# Altium schematic sheet Microcontroller.SchDoc
size A
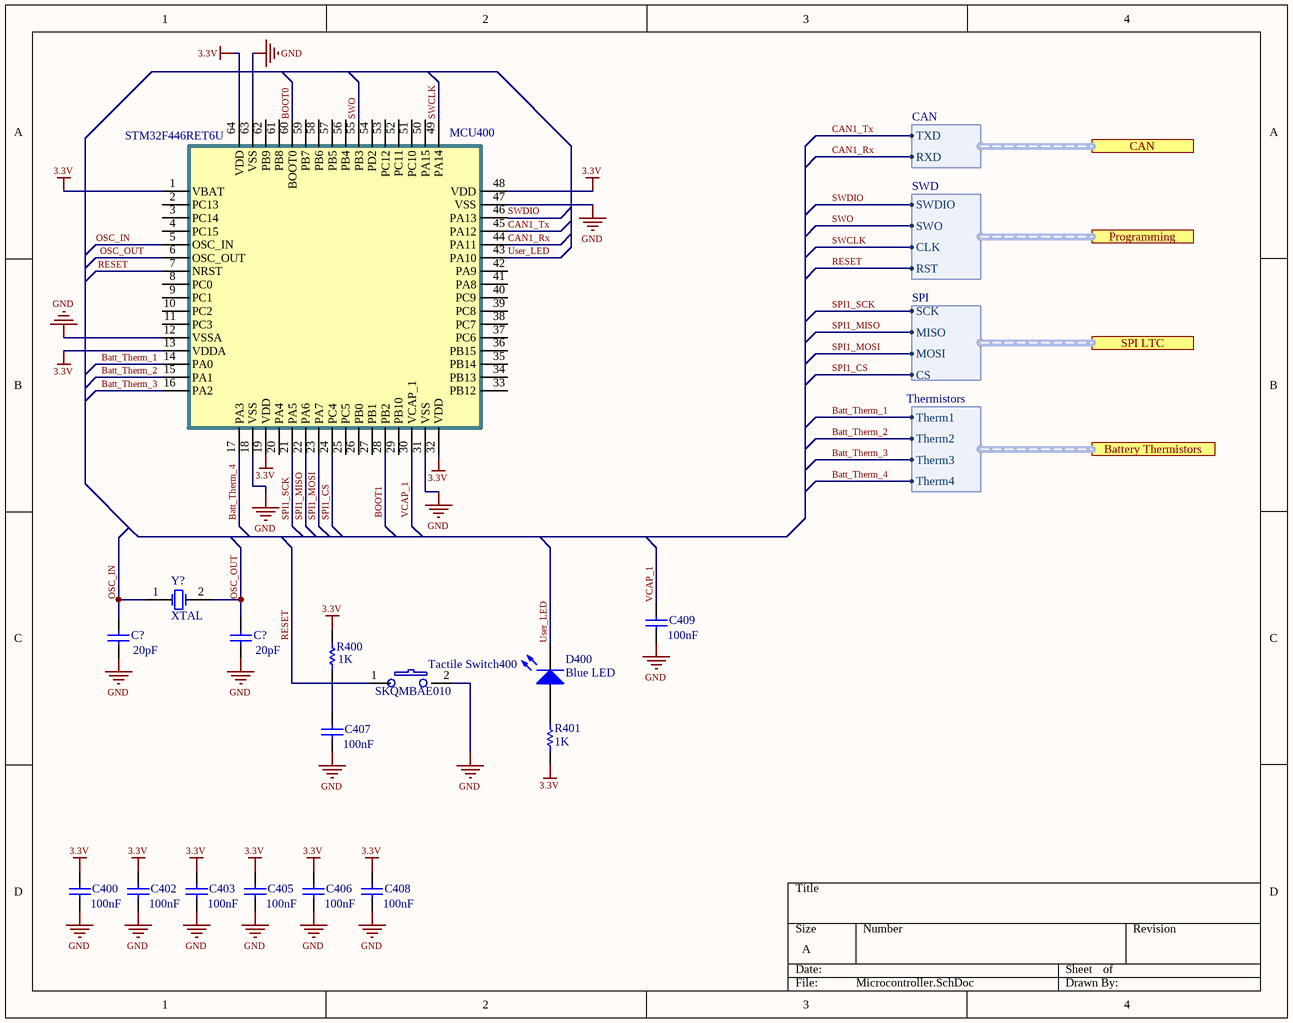
[diagram p0: Microcontroller.SchDoc]

## Parts
(Parts that share a designator on the sheet are numbered #1, #2 ... from top to bottom, then left to right.)
C400  value 100nF  [RAD-0.3]  (hidden comment: Cap)
C402  value 100nF  [RAD-0.3]  (hidden comment: Cap)
C403  value 100nF  [RAD-0.3]  (hidden comment: Cap)
C405  value 100nF  [RAD-0.3]  (hidden comment: Cap)
C406  value 100nF  [RAD-0.3]  (hidden comment: Cap)
C407  value 100nF  [RAD-0.3]  (hidden comment: Cap)
C408  value 100nF  [RAD-0.3]  (hidden comment: Cap)
C409  value 100nF  [RAD-0.3]  (hidden comment: Cap)
C?#1  value 20pF  [RAD-0.3]  (hidden comment: Cap)
C?#2  value 20pF  [RAD-0.3]  (hidden comment: Cap)
D400  Blue LED  [LED-0]
MCU400  STM32F446RET6U  [LQFP50P1200X1200X160-64N]
R400  value 1K  [AXIAL-0.3]  (hidden comment: Res1)
R401  value 1K  [AXIAL-0.3]  (hidden comment: Res1)
Tactile_Switch400  SKQMBAE010  [SKTHBAE010]
Y?  XTAL  [FOXSDLF/080-20]

## Ports
Battery Thermistors (harness Thermistors), CAN (harness CAN), Programming (harness SWD), SPI LTC (harness SPI)

## Harnesses
CAN: RXD, TXD
SWD: RST, CLK, SWO, SWDIO
SPI: CS, MOSI, MISO, SCK
Thermistors: Therm3, Therm4, Therm2, Therm1

## Nets
3.3V: C400.1 C402.1 C403.1 C405.1 C406.1 C408.1 MCU400.1(VBAT) MCU400.13(VDDA) MCU400.19(VDD) MCU400.32(VDD) MCU400.48(VDD) MCU400.64(VDD) R400.2 R401.2
GND: C400.2 C402.2 C403.2 C405.2 C406.2 C407.2 C408.2 C409.2 C?#1.2 C?#2.2 MCU400.12(VSSA) MCU400.18(VSS) MCU400.31(VSS) MCU400.47(VSS) MCU400.63(VSS) Tactile_Switch400.2
Batt_Therm_1: MCU400.14(PA0) ; port Battery Thermistors.Therm1
Batt_Therm_2: MCU400.15(PA1) ; port Battery Thermistors.Therm2
Batt_Therm_3: MCU400.16(PA2) ; port Battery Thermistors.Therm3
Batt_Therm_4: MCU400.17(PA3) ; port Battery Thermistors.Therm4
BOOT0: MCU400.60(BOOT0)
BOOT1: MCU400.28(PB2)
CAN1_Rx: MCU400.44(PA11) ; port CAN.RXD
CAN1_Tx: MCU400.45(PA12) ; port CAN.TXD
OSC_IN: C?#1.1 MCU400.5(OSC_IN) Y?.1(OSC1)
OSC_OUT: C?#2.1 MCU400.6(OSC_OUT) Y?.2(OSC2)
RESET: C407.1 MCU400.7(NRST) R400.1 Tactile_Switch400.1 ; port Programming.RST
SPI1_CS: MCU400.24(PC4) ; port SPI LTC.CS
SPI1_MISO: MCU400.22(PA6) ; port SPI LTC.MISO
SPI1_MOSI: MCU400.23(PA7) ; port SPI LTC.MOSI
SPI1_SCK: MCU400.21(PA5) ; port SPI LTC.SCK
SWCLK: MCU400.49(PA14) ; port Programming.CLK
SWDIO: MCU400.46(PA13) ; port Programming.SWDIO
SWO: MCU400.55(PB3) ; port Programming.SWO
User_LED: D400.2(K) MCU400.43(PA10)
VCAP_1: C409.1 MCU400.30(VCAP_1)
NetD400_1: D400.1(A) R401.1

Not connected (* = marked no-connect by the designer): MCU400 2(PC13) 3(PC14) 4(PC15) 8(PC0) 9(PC1) 10(PC2) 11(PC3) 20(PA4) 25(PC5) 26(PB0) 27(PB1) 29(PB10) 33(PB12) 34(PB13) 35(PB14) 36(PB15) 37(PC6) 38(PC7) 39(PC8) 40(PC9) 41(PA8) 42(PA9) 50(PA15) 51(PC10) 52(PC11) 53(PC12) 54(PD2) 56(PB4) 57(PB5) 58(PB6) 59(PB7) 61(PB8) 62(PB9)

## Library data of the parts
C400 C402 C403 C405-C409 C?#1 C?#2 = Cap: Capacitor; Published: 8-Jun-2000; LatestRevisionDate: 17-Jul-2002; LatestRevisionNote: Re-released for DXP Platform.; PackageReference: RAD-0.3; Publisher: Altium Limited; PackageDescription: Radial Cap, Thru-Hole; 2 Leads; 0.3 in Pin Spacing
D400 = LED0: Typical INFRARED GaAs LED; Published: 8-Jun-2000; LatestRevisionDate: 08-Jul-2005; LatestRevisionNote: Mech Layer 1 removed.; PackageReference: LED-0; Publisher: Altium Limited; PackageDescription: LED; 2 Leads
MCU400 = STM32F446RET6U: ARM® Cortex®-M4 32b MCU+FPU, 225DMIPS, up to 512kB Flash/128+4KB RAM, USB OTG HS/FS, 17 TIMs, 3 ADCs, 20 comm. interfaces
R400 R401 = Res1: Resistor; Published: 8-Jun-2000; LatestRevisionDate: 17-Jul-2002; LatestRevisionNote: Re-released for DXP Platform.; PackageReference: AXIAL-0.3; Publisher: Altium Limited; PackageDescription: Axial Device, Thru-Hole; 2 Leads; 0.3 in Pin Spacing
Tactile_Switch400 = SKQMBAE010: ALPS 6.0x3.5x4.3mm SMD Tactile Switch, Ratings 50mA/12VDC
Y? = XTAL: Crystal Oscillator; Published: 8-Jun-2000; LatestRevisionDate: 17-Jul-2002; LatestRevisionNote: Re-released for DXP Platform.; PackageReference: R38; Publisher: Altium Limited; PackageDescription: Crystal, Thru-Hole; 2 Leads; Body 3.1 x 8.2 mm (Dia.xH)